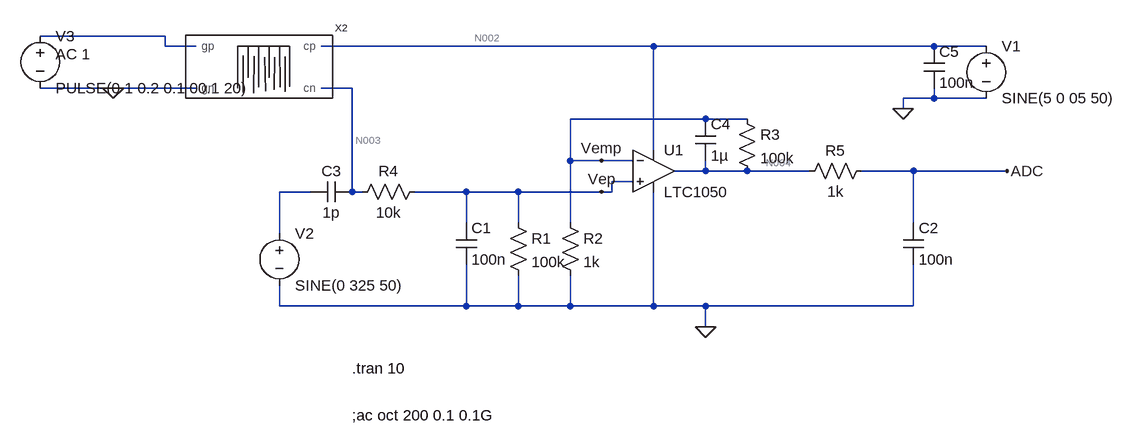
[diagram p0: schematic ElectronicAnalog1.asc]
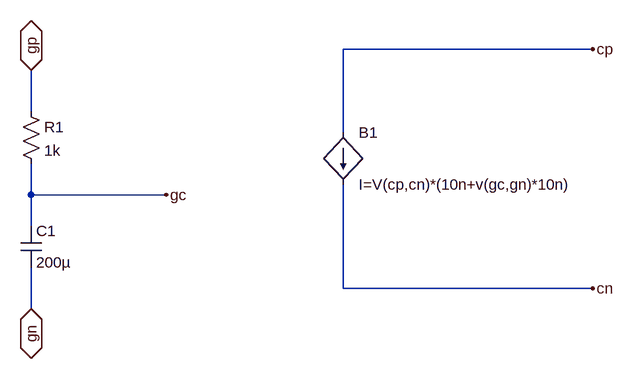
[diagram p1: sub-circuit gp_capteur.asc]
ElectronicAnalog1.asc, the LTspice schematic file:
Version 4
SHEET 1 1012 680
WIRE -464 -96 -656 -96
WIRE -464 -80 -464 -96
WIRE -416 -80 -464 -80
WIRE 288 -80 -224 -80
WIRE 720 -80 288 -80
WIRE 800 -80 720 -80
WIRE -544 -16 -656 -16
WIRE -416 -16 -544 -16
WIRE -176 -16 -224 -16
WIRE 720 0 720 -16
WIRE 720 0 672 0
WIRE 800 0 720 0
WIRE 672 16 672 0
WIRE 368 32 160 32
WIRE 432 32 368 32
WIRE 288 80 288 -80
WIRE 160 96 160 32
WIRE 208 96 160 96
WIRE 256 96 208 96
WIRE 368 112 368 96
WIRE 368 112 320 112
WIRE 432 112 368 112
WIRE 528 112 432 112
WIRE 688 112 608 112
WIRE 832 112 688 112
WIRE 256 128 224 128
WIRE -240 144 -288 144
WIRE -176 144 -176 -16
WIRE -160 144 -176 144
WIRE 0 144 -80 144
WIRE 80 144 0 144
WIRE 208 144 80 144
WIRE 224 144 224 128
WIRE 224 144 208 144
WIRE 0 192 0 144
WIRE 80 192 80 144
WIRE 160 192 160 96
WIRE 688 192 688 112
WIRE -288 208 -288 144
WIRE -288 320 -288 288
WIRE 0 320 0 256
WIRE 0 320 -288 320
WIRE 80 320 80 272
WIRE 80 320 0 320
WIRE 160 320 160 272
WIRE 160 320 80 320
WIRE 288 320 288 144
WIRE 288 320 160 320
WIRE 368 320 288 320
WIRE 688 320 688 256
WIRE 688 320 368 320
WIRE 368 352 368 320
FLAG 368 352 0
FLAG 672 16 0
FLAG 832 112 ADC
FLAG -544 -16 0
FLAG 208 96 Vemp
FLAG 208 144 Vep
SYMBOL res 64 176 R0
SYMATTR InstName R1
SYMATTR Value 100k
SYMBOL res 144 176 R0
SYMATTR InstName R2
SYMATTR Value 1k
SYMBOL res 416 16 R0
SYMATTR InstName R3
SYMATTR Value 100k
SYMBOL res -64 128 R90
WINDOW 0 0 56 VBottom 2
WINDOW 3 32 56 VTop 2
SYMATTR InstName R4
SYMATTR Value 10k
SYMBOL res 624 96 R90
WINDOW 0 0 56 VBottom 2
WINDOW 3 32 56 VTop 2
SYMATTR InstName R5
SYMATTR Value 1k
SYMBOL cap -16 192 R0
SYMATTR InstName C1
SYMATTR Value 100n
SYMBOL cap 672 192 R0
SYMATTR InstName C2
SYMATTR Value 100n
SYMBOL cap 352 32 R0
SYMATTR InstName C4
SYMATTR Value 1µ
SYMBOL OpAmps\\LTC1050 288 48 R0
SYMATTR InstName U1
SYMBOL voltage 800 -96 R0
WINDOW 123 24 44 Left 2
WINDOW 39 0 0 Left 0
SYMATTR InstName V1
SYMATTR Value SINE(5 0 05 50)
SYMBOL GP_Capteur -320 -48 R0
SYMATTR InstName X2
SYMBOL cap -176 128 R90
WINDOW 0 0 32 VBottom 2
WINDOW 3 32 32 VTop 2
SYMATTR InstName C3
SYMATTR Value 1p
SYMBOL voltage -288 192 R0
WINDOW 123 0 0 Left 0
WINDOW 39 0 0 Left 0
SYMATTR InstName V2
SYMATTR Value SINE(0 325 50)
SYMBOL voltage -656 -112 R0
WINDOW 123 24 44 Left 2
WINDOW 39 0 0 Left 0
SYMATTR Value2 AC 1
SYMATTR InstName V3
SYMATTR Value PULSE(0 1 0.2 0.1 00.1 20)
SYMBOL cap 704 -80 R0
SYMATTR InstName C5
SYMATTR Value 100n
TEXT -176 416 Left 2 !.tran 10
TEXT -176 488 Left 2 !;ac oct 200 0.1 0.1G

gp_capteur.asc, the sub-circuit schematic file:
Version 4
SHEET 1 988 680
WIRE 944 32 560 32
WIRE 80 128 80 64
WIRE 560 160 560 32
WIRE 80 256 80 208
WIRE 288 256 80 256
WIRE 80 304 80 256
WIRE 560 400 560 240
WIRE 944 400 560 400
WIRE 80 432 80 368
FLAG 80 64 gp
IOPIN 80 64 BiDir
FLAG 80 432 gn
IOPIN 80 432 BiDir
FLAG 288 256 gc
FLAG 944 32 cp
FLAG 944 400 cn
SYMBOL res 64 112 R0
SYMATTR InstName R1
SYMATTR Value 1k
SYMBOL cap 64 304 R0
SYMATTR InstName C1
SYMATTR Value 200µ
SYMBOL bi 560 160 R0
SYMATTR InstName B1
SYMATTR Value I=V(cp,cn)*(10n+v(gc,gn)*10n)

The netlist it stands for:
* ElectronicAnalog1.asc
R1 Vep 0 100k
R2 Vemp 0 1k
R3 Vemp N004 100k
R4 Vep N003 10k
R5 ADC N004 1k
C1 Vep 0 100n
C2 ADC 0 100n
C4 Vemp N004 1µ
XU1 Vep Vemp N002 0 N004 LTC1050  ; pins In+ In- V+ V- OUT
V1 N002 0 SINE(5 0 05 50)
XX2 N002 N003 N001 0 gp_capteur
C3 N003 N005 1p
V2 N005 0 SINE(0 325 50)
V3 N001 0 PULSE(0 1 0.2 0.1 00.1 20) AC 1
C5 N002 0 100n

* block symbol definitions
.subckt gp_capteur cp cn gp gn
R1 gp gc 1k
C1 gc gn 200µ
B1 cp cn I=V(cp,cn)*(10n+v(gc,gn)*10n)
.ends gp_capteur

.tran 10
;ac oct 200 0.1 0.1G
.lib LTC.lib
.backanno
.end

* Results of the author's LTspice run, read from the files saved beside the schematic
* Operating Point, zero values left out:
*   V(vep) = 4.995 mV
*   V(vemp) = 4.995 mV
*   V(n004) = 504.4 mV
*   V(n003) = 5.494 mV
*   V(adc) = 504.4 mV
*   V(n002) = 5 V
*   I(R4) = -49.95 nA
*   I(R3) = -4.995 µA
*   I(R2) = 4.995 µA
*   I(R1) = 49.95 nA
*   I(V1) = -754.2 µA
*   Ix(u1:3) = 754.1 µA
*   Ix(u1:4) = -749.1 µA
*   Ix(u1:5) = -4.995 µA
*   Ix(x2:CP) = 49.95 nA
*   Ix(x2:CN) = -49.95 nA
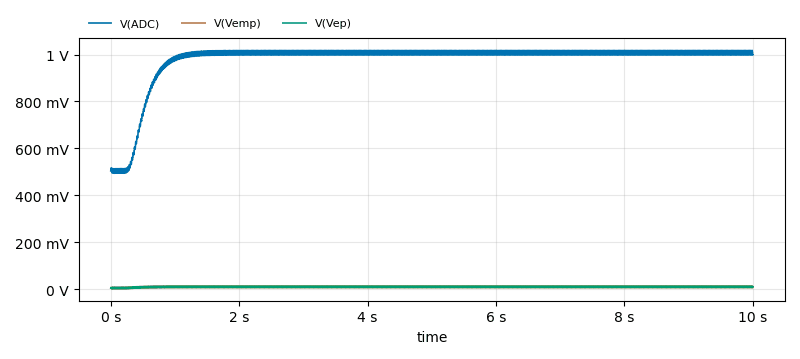
[diagram p2: Transient Analysis of ElectronicAnalog1.asc, plotted from the saved traces]
* Transient Analysis, 1 run:
*   V(ADC): min 493.8 mV, max 1.018 V, average 979.6 mV, rms 985 mV, last 999.3 mV
*   V(Vemp): min 1.679 mV, max 13.06 mV, average 9.748 mV, rms 10.03 mV, last 10.91 mV
*   V(Vep): min 1.679 mV, max 13.06 mV, average 9.748 mV, rms 10.03 mV, last 10.91 mV